# Altium schematic sheet TC3608H.SchDoc
size 292 x 193 mm; Author: Power Lin; SheetNumber: 1; SheetTotal: 1; Website: wiki-power.com
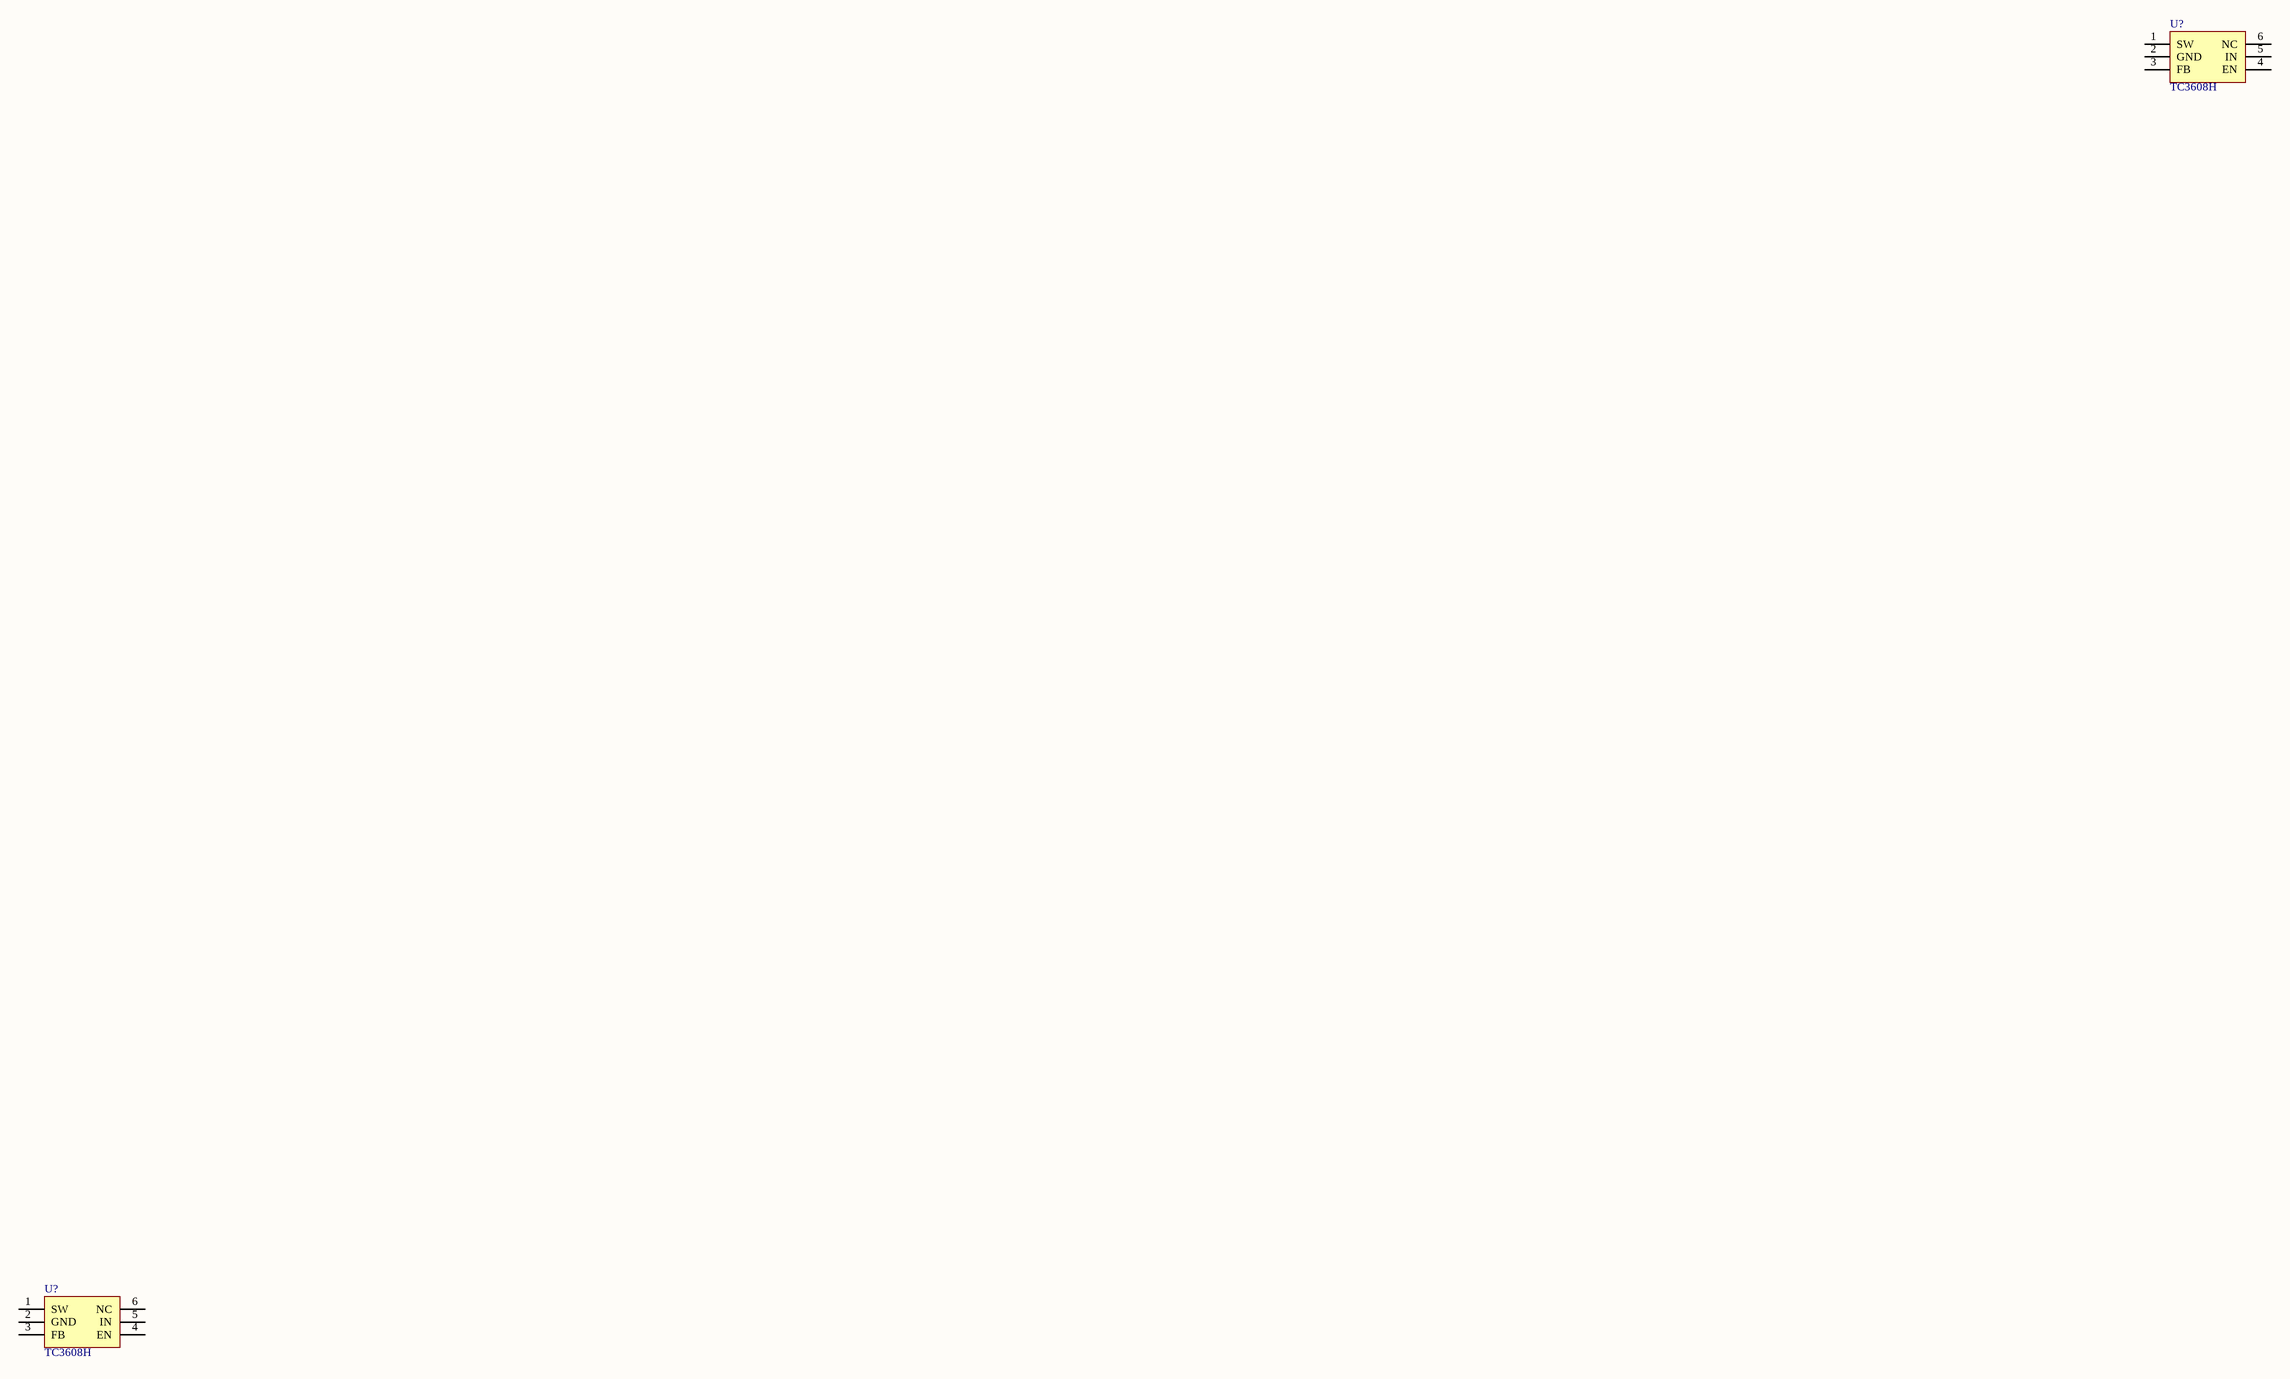
[diagram p0: TC3608H.SchDoc]

## Parts
(Parts that share a designator on the sheet are numbered #1, #2 ... from top to bottom, then left to right.)
U?#1  TC3608H  [SOT-23-6]
U?#2  TC3608H  [SOT-23-6]

## Nets

Not connected (* = marked no-connect by the designer): U?#1 1(SW) 2(GND) 3(FB) 4(EN) 5(IN) 6(NC); U?#2 1(SW) 2(GND) 3(FB) 4(EN) 5(IN) 6(NC)

## Notes on the sheet
- Author
- DocumentName
- ModifiedDate
- ProjectName
- SheetNumber
- SheetTotal
- Website
- Revision

## Library data of the parts
U?#1 U?#2 = TC3608H: Boost; Manufacturer_Name: International Rectifier; Manufacturer_Part_Number: IR2103SPBF; Datasheet Link: https://www.infineon.com/dgdl/ir2103.pdf?fileId=5546d462533600a4015355c7b54b166f; Height: 1.75mm